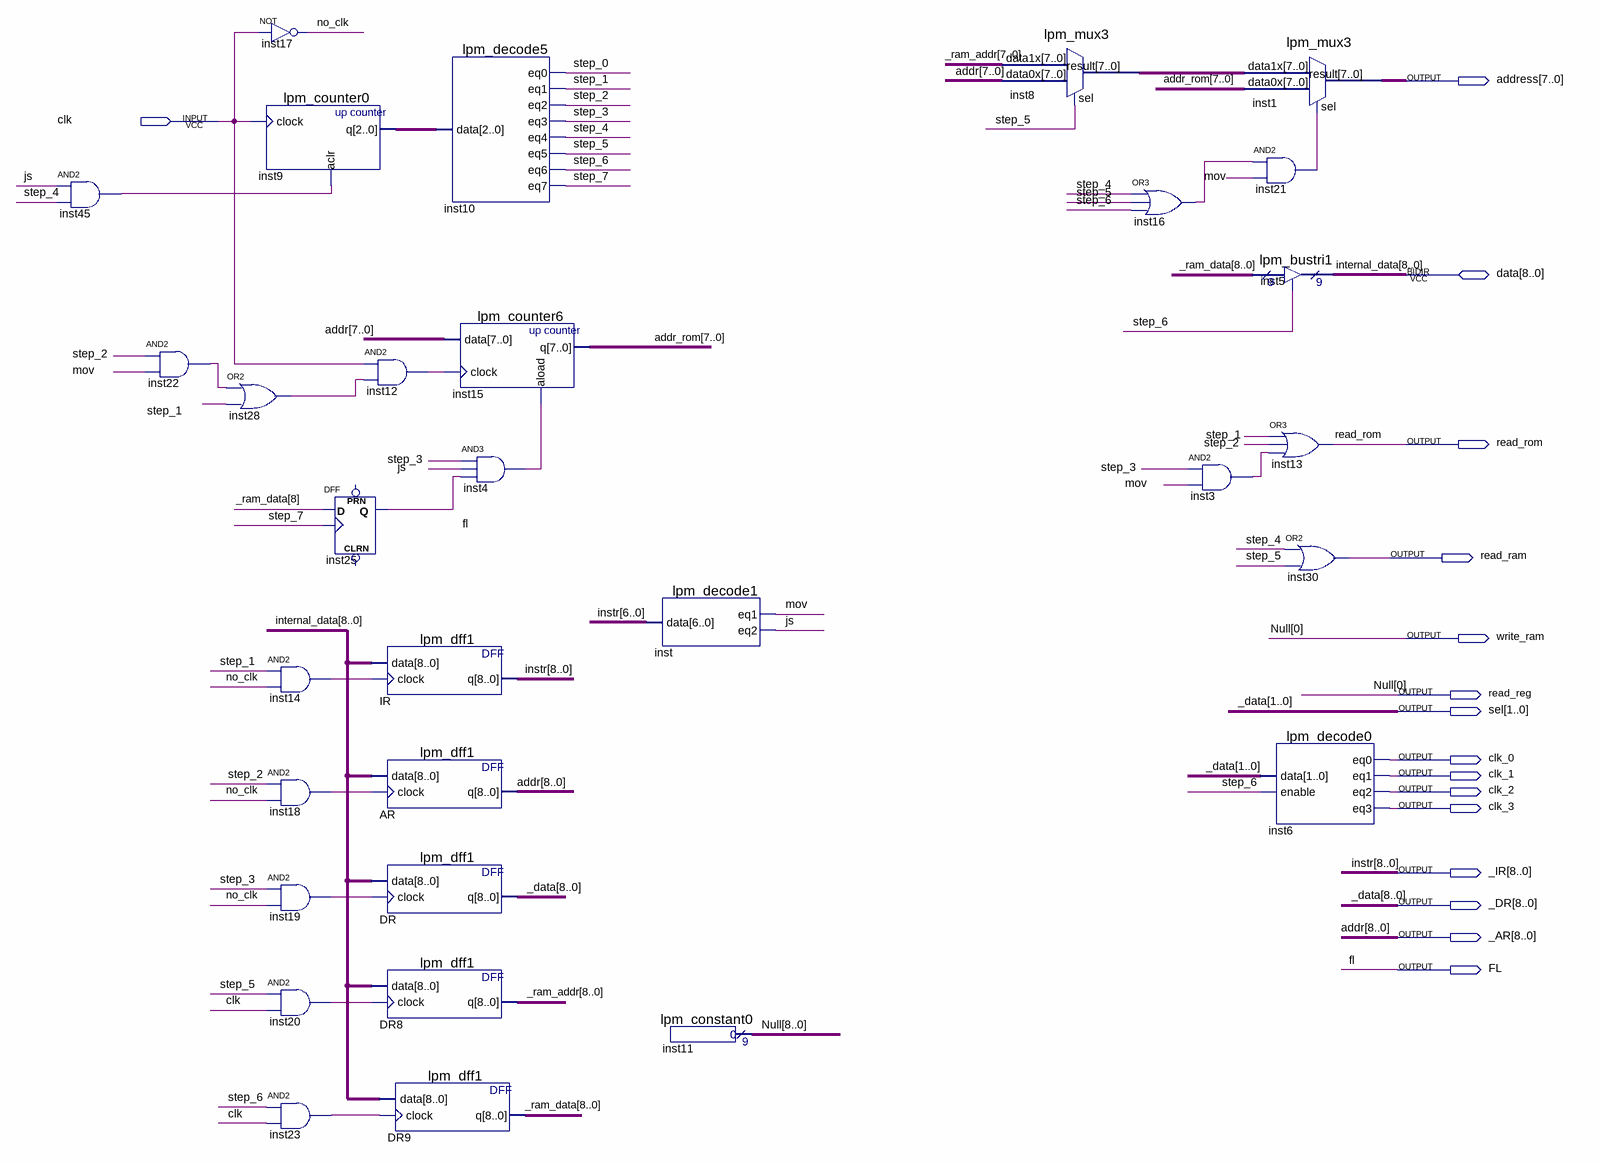
[diagram p0: schematic sheet]
// Quartus schematic cu.bdf as structural Verilog: 31 symbols, 16 pins
module cu (
  input  clk,
  inout  [8:0] data,
  output [7:0] address,
  output read_rom,
  output read_ram,
  output write_ram,
  output read_reg,
  output [1:0] sel,
  output clk_0,
  output clk_1,
  output clk_2,
  output clk_3,
  output [8:0] _IR,
  output [8:0] _DR,
  output [8:0] _AR,
  output FL
);

  wire inst3_out, inst4_out, inst12_out, inst14_out, inst16_out, inst18_out, inst19_out, inst20_out,
       inst21_out, inst22_out, inst23_out, inst28_out, inst45_out, js, mov, no_clk, step_0, step_1, step_2,
       step_3, step_4, step_5, step_6, step_7;
  wire [2:0] inst9_q;
  wire [7:0] addr_rom, inst8_result;
  wire [8:0] _ram_addr, _ram_data;
  wire [8:1] Null;

  and inst45 (inst45_out, js, step_4);
  and inst22 (inst22_out, step_2, mov);
  or inst28 (inst28_out, inst22_out, step_1);
  not inst17 (no_clk, clk);
  lpm_counter0 inst9 (.clock(clk), .aclr(inst45_out), .q(inst9_q));
  and inst14 (inst14_out, step_1, no_clk);
  and inst18 (inst18_out, step_2, no_clk);
  and inst19 (inst19_out, step_3, no_clk);
  and inst20 (inst20_out, step_5, clk);
  and inst23 (inst23_out, step_6, clk);
  DFF inst25 (.CLK(step_7), .D(_ram_data[8]), .Q(FL));  // open: CLRN, PRN
  and inst12 (inst12_out, clk, inst28_out);
  lpm_dff1 IR (.data(data), .clock(inst14_out), .q(_IR));
  lpm_dff1 AR (.data(data), .clock(inst18_out), .q(_AR));
  lpm_dff1 DR (.data(data), .clock(inst19_out), .q(_DR));
  lpm_dff1 DR8 (.data(data), .clock(inst20_out), .q(_ram_addr));
  lpm_dff1 DR9 (.data(data), .clock(inst23_out), .q(_ram_data));
  lpm_decode5 inst10 (
    .data(inst9_q), .eq0(step_0), .eq1(step_1), .eq2(step_2), .eq3(step_3), .eq4(step_4), .eq5(step_5),
    .eq6(step_6), .eq7(step_7));
  lpm_counter6 inst15 (.data(_AR[7:0]), .clock(inst12_out), .aload(inst4_out), .q(addr_rom));
  and inst4 (inst4_out, step_3, js, FL);
  lpm_decode1 inst (.data(_IR[6:0]), .eq1(mov), .eq2(js));
  lpm_constant0 inst11 (.result({Null, read_reg}));
  lpm_mux3 inst8 (.data1x(_ram_addr[7:0]), .data0x(_AR[7:0]), .sel(step_5), .result(inst8_result));
  or inst16 (inst16_out, step_4, step_5, step_6);
  and inst3 (inst3_out, step_3, mov);
  lpm_mux3 inst1 (.data1x(inst8_result), .data0x(addr_rom), .sel(inst21_out), .result(address));
  and inst21 (inst21_out, inst16_out, mov);
  lpm_bustri1 inst5 (.enabledt(step_6), .data(_ram_data), .tridata(data));
  lpm_decode0 inst6 (.data(_DR[1:0]), .enable(step_6), .eq0(clk_0), .eq1(clk_1), .eq2(clk_2), .eq3(clk_3));
  or inst13 (read_rom, step_1, step_2, inst3_out);
  or inst30 (read_ram, step_4, step_5);

  assign sel = _DR[1:0];
  assign write_ram = read_reg;

  // Other names for the same wires on the sheet: _data[8:0] = _DR; addr[8:0] = _AR; instr[8:0] = _IR;
  //   internal_data[8:0] = data; Null[0] = read_reg
endmodule
